# Altium schematic sheet 0054_DISPLAY - DDIA POR.SchDoc
size A3
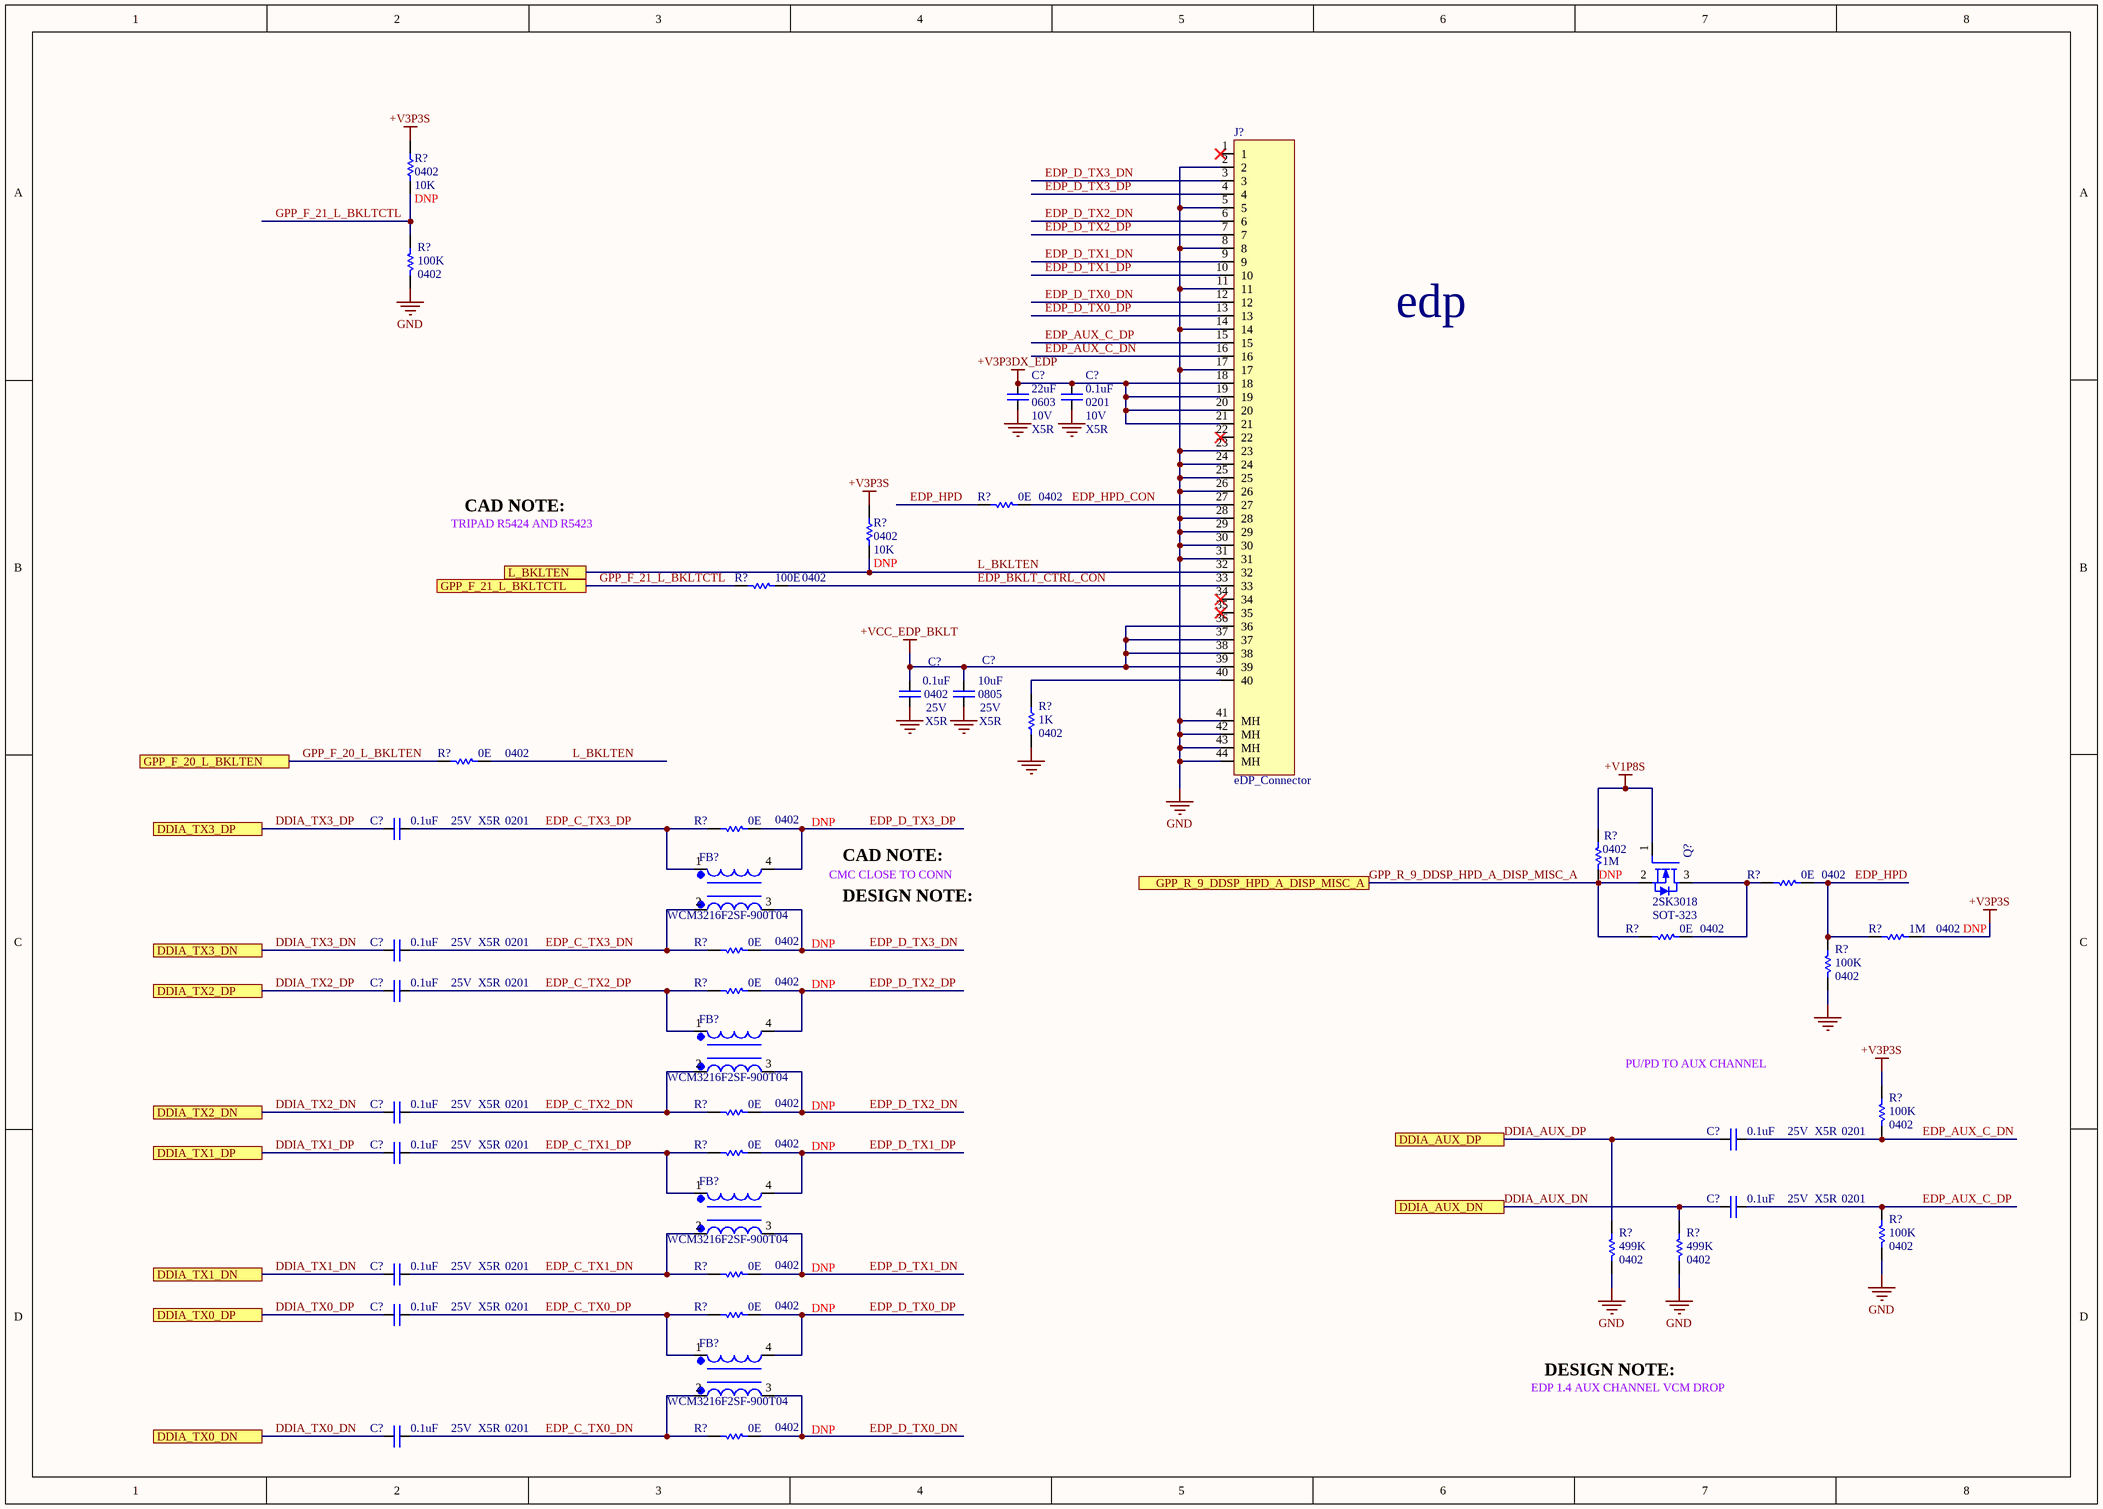
[diagram p0: 0054_DISPLAY - DDIA POR.SchDoc]

## Parts
(Parts that share a designator on the sheet are numbered #1, #2 ... from top to bottom, then left to right.)
C?#1  value 22uF  Case/Package: 0603  Voltage: 10V  Dielectric: X5R  [CAPC0603]
C?#2  value 0.1uF  Case/Package: 0201  Voltage: 10V  Dielectric: X5R  [CAPC0201]
C?#3  value 0.1uF  Case/Package: 0402  Voltage: 25V  Dielectric: X5R  [CAPC0402]
C?#4  value 10uF  Case/Package: 0805  Voltage: 25V  Dielectric: X5R  [CAPC0805]
C?#5  value 0.1uF  Case/Package: 0201  Voltage: 25V  Dielectric: X5R  [CAPC0201]
C?#6  value 0.1uF  Case/Package: 0201  Voltage: 25V  Dielectric: X5R  [CAPC0201]
C?#7  value 0.1uF  Case/Package: 0201  Voltage: 25V  Dielectric: X5R  [CAPC0201]
C?#8  value 0.1uF  Case/Package: 0201  Voltage: 25V  Dielectric: X5R  [CAPC0201]
C?#9  value 0.1uF  Case/Package: 0201  Voltage: 25V  Dielectric: X5R  [CAPC0201]
C?#10  value 0.1uF  Case/Package: 0201  Voltage: 25V  Dielectric: X5R  [CAPC0201]
C?#11  value 0.1uF  Case/Package: 0201  Voltage: 25V  Dielectric: X5R  [CAPC0201]
C?#12  value 0.1uF  Case/Package: 0201  Voltage: 25V  Dielectric: X5R  [CAPC0201]
C?#13  value 0.1uF  Case/Package: 0201  Voltage: 25V  Dielectric: X5R  [CAPC0201]
C?#14  value 0.1uF  Case/Package: 0201  Voltage: 25V  Dielectric: X5R  [CAPC0201]
FB?#1  WCM3216F2SF-900T04  [CHOKE]
FB?#2  WCM3216F2SF-900T04  [CHOKE]
FB?#3  WCM3216F2SF-900T04  [CHOKE]
FB?#4  WCM3216F2SF-900T04  [CHOKE]
J?  eDP_Connector
Q?  Manufacturer Part Number: 2SK3018  Case/Package: SOT-323  [SOT323]  (hidden comment: MOSFET N_2SK3018)
R?#1  value 10K  Case/Package: 0402  [RESC0402]  (hidden comment: Res)
R?#2  value 100K  Case/Package: 0402  [RESC0402]  (hidden comment: Res)
R?#3  value 0E  Case/Package: 0402  [RESC0402]  (hidden comment: Res)
R?#4  value 10K  Case/Package: 0402  [RESC0402]  (hidden comment: Res)
R?#5  value 100E  Case/Package: 0402  [RESC0402]  (hidden comment: Res)
R?#6  value 1K  Case/Package: 0402  [RESC0402]  (hidden comment: Res)
R?#7  value 0E  Case/Package: 0402  [RESC0402]  (hidden comment: Res)
R?#8  value 0E  Case/Package: 0402  [RESC0402]  (hidden comment: Res)
R?#9  value 1M  Case/Package: 0402  [RESC0402]  (hidden comment: Res)
R?#10  value 0E  Case/Package: 0402  [RESC0402]  (hidden comment: Res)
R?#11  value 0E  Case/Package: 0402  [RESC0402]  (hidden comment: Res)
R?#12  value 1M  Case/Package: 0402  [RESC0402]  (hidden comment: Res)
R?#13  value 0E  Case/Package: 0402  [RESC0402]  (hidden comment: Res)
R?#14  value 100K  Case/Package: 0402  [RESC0402]  (hidden comment: Res)
R?#15  value 0E  Case/Package: 0402  [RESC0402]  (hidden comment: Res)
R?#16  value 0E  Case/Package: 0402  [RESC0402]  (hidden comment: Res)
R?#17  value 100K  Case/Package: 0402  [RESC0402]  (hidden comment: Res)
R?#18  value 0E  Case/Package: 0402  [RESC0402]  (hidden comment: Res)
R?#19  value 100K  Case/Package: 0402  [RESC0402]  (hidden comment: Res)
R?#20  value 499K  Case/Package: 0402  [RESC0402]  (hidden comment: Res)
R?#21  value 499K  Case/Package: 0402  [RESC0402]  (hidden comment: Res)
R?#22  value 0E  Case/Package: 0402  [RESC0402]  (hidden comment: Res)
R?#23  value 0E  Case/Package: 0402  [RESC0402]  (hidden comment: Res)
R?#24  value 0E  Case/Package: 0402  [RESC0402]  (hidden comment: Res)

## Ports
DDIA_AUX_DN, DDIA_AUX_DP, DDIA_TX0_DN, DDIA_TX0_DP, DDIA_TX1_DN, DDIA_TX1_DP, DDIA_TX2_DN, DDIA_TX2_DP, DDIA_TX3_DN, DDIA_TX3_DP, GPP_F_20_L_BKLTEN, GPP_F_21_L_BKLTCTL, GPP_R_9_DDSP_HPD_A_DISP_MISC_A, L_BKLTEN

## Nets
+V1P8S: Q?.1(GATE) R?#9.2
+V3P3DX_EDP: C?#1.2 C?#2.2 J?.18 J?.19 J?.20 J?.21
+V3P3S: R?#1.2 R?#4.2 R?#12.1 R?#17.2
+VCC_EDP_BKLT: C?#3.2 C?#4.2 J?.36 J?.37 J?.38 J?.39
GND: C?#1.1 C?#2.1 C?#3.1 C?#4.1 J?.2 J?.5 J?.8 J?.11 J?.14 J?.17 J?.23 J?.24 J?.25 J?.26 J?.28 J?.29 J?.30 J?.31 J?.41(MH) J?.42(MH) J?.43(MH) J?.44(MH) R?#2.1 R?#6.1 R?#14.1 R?#19.1 R?#20.1 R?#21.1
DDIA_AUX_DN: C?#11.2 R?#21.2 ; port DDIA_AUX_DN
DDIA_AUX_DP: C?#9.2 R?#20.2 ; port DDIA_AUX_DP
DDIA_TX0_DN: C?#14.2 ; port DDIA_TX0_DN
DDIA_TX0_DP: C?#13.2 ; port DDIA_TX0_DP
DDIA_TX1_DN: C?#12.2 ; port DDIA_TX1_DN
DDIA_TX1_DP: C?#10.2 ; port DDIA_TX1_DP
DDIA_TX2_DN: C?#8.2 ; port DDIA_TX2_DN
DDIA_TX2_DP: C?#7.2 ; port DDIA_TX2_DP
DDIA_TX3_DN: C?#6.2 ; port DDIA_TX3_DN
DDIA_TX3_DP: C?#5.2 ; port DDIA_TX3_DP
EDP_AUX_C_DN: C?#9.1 J?.16 R?#17.1
EDP_AUX_C_DP: C?#11.1 J?.15 R?#19.2
EDP_BKLT_CTRL_CON: J?.33 R?#5.2
EDP_C_TX0_DN: C?#14.1 FB?#4.2 R?#24.1
EDP_C_TX0_DP: C?#13.1 FB?#4.1 R?#23.1
EDP_C_TX1_DN: C?#12.1 FB?#3.2 R?#22.1
EDP_C_TX1_DP: C?#10.1 FB?#3.1 R?#18.1
EDP_C_TX2_DN: C?#8.1 FB?#2.2 R?#16.1
EDP_C_TX2_DP: C?#7.1 FB?#2.1 R?#15.1
EDP_C_TX3_DN: C?#6.1 FB?#1.2 R?#13.1
EDP_C_TX3_DP: C?#5.1 FB?#1.1 R?#8.1
EDP_D_TX0_DN: FB?#4.3 J?.12 R?#24.2
EDP_D_TX0_DP: FB?#4.4 J?.13 R?#23.2
EDP_D_TX1_DN: FB?#3.3 J?.9 R?#22.2
EDP_D_TX1_DP: FB?#3.4 J?.10 R?#18.2
EDP_D_TX2_DN: FB?#2.3 J?.6 R?#16.2
EDP_D_TX2_DP: FB?#2.4 J?.7 R?#15.2
EDP_D_TX3_DN: FB?#1.3 J?.3 R?#13.2
EDP_D_TX3_DP: FB?#1.4 J?.4 R?#8.2
EDP_HPD: R?#3.1 R?#10.2 R?#12.2 R?#14.2
EDP_HPD_CON: J?.27 R?#3.2
GPP_F_20_L_BKLTEN: R?#7.1 ; port GPP_F_20_L_BKLTEN
GPP_F_21_L_BKLTCTL: R?#1.1 R?#2.2 R?#5.1 ; port GPP_F_21_L_BKLTCTL
GPP_R_9_DDSP_HPD_A_DISP_MISC_A: Q?.2(SOURCE) R?#9.1 R?#11.1 ; port GPP_R_9_DDSP_HPD_A_DISP_MISC_A
L_BKLTEN: J?.32 R?#4.1 R?#7.2 ; port L_BKLTEN
NetJ?_40: J?.40 R?#6.2
NetQ?_3: Q?.3(DRAIN) R?#10.1 R?#11.2

Not connected (* = marked no-connect by the designer): J? 1* 22* 34* 35*

## Notes on the sheet
- edp
- CAD NOTE:
- TRIPAD R5424 AND R5423
- CMC CLOSE TO CONN
- DESIGN NOTE:
- PU/PD TO AUX CHANNEL
- EDP 1.4 AUX CHANNEL VCM DROP

## Library data of the parts
C?#1 = Cap: CAP CER 22uF 10V X5R 0603
C?#2 = Cap: CAP CER 0.1uF 10V X5R 0201
C?#3 = Cap: CAP CER 0.1uF 25V X5R 0402
C?#4 = Cap: CAP CER 10uF 25V X5R 0805
C?#5-C?#14 = Cap: CAP CER 0.1uF 25V X5R 0201
FB?#1-FB?#4 = WCM3216F2SF-900T04: Power, Signal Line 90 Ohms @ 100MHz 300 mOhm 50V SMD,3.2x1.6x2mm Common Mode Filters RoHS; Manufacturer Part Number: WCM3216F2SF-900T04; Case/Package: 3.2x1.6x2mm
Q? = MOSFET N_2SK3018: NMOS,2SK3018,SOT_323,Id=0.1A,Vds=30V
R?#1 R?#4 = Res: Thick Film Resistor -  10Kohm, 1%, 0402; DNP: DNP
R?#2 R?#14 R?#17 R?#19 = Res: Thick Film Resistor -  100Kohm, 1%, 0402
R?#3 R?#7 R?#8 R?#10 R?#11 R?#13 R?#15 R?#16 R?#18 R?#22-R?#24 = Res: Thick Film Resistor -  0ohm, 1%, 0402
  R?#8 R?#13 R?#15 R?#16 R?#18 R?#22-R?#24: DNP: DNP
R?#5 = Res: Thick Film Resistor - 100ohm, 1%, 0402
R?#6 = Res: Thick Film Resistor -  1Kohm, 1%, 0402
R?#9 R?#12 = Res: Thick Film Resistor -  1MOhm, 1%, 0402; DNP: DNP
R?#20 R?#21 = Res: Thick Film Resistor -  499Kohm, 1%, 0402